# Altium project B38.PrjPcb
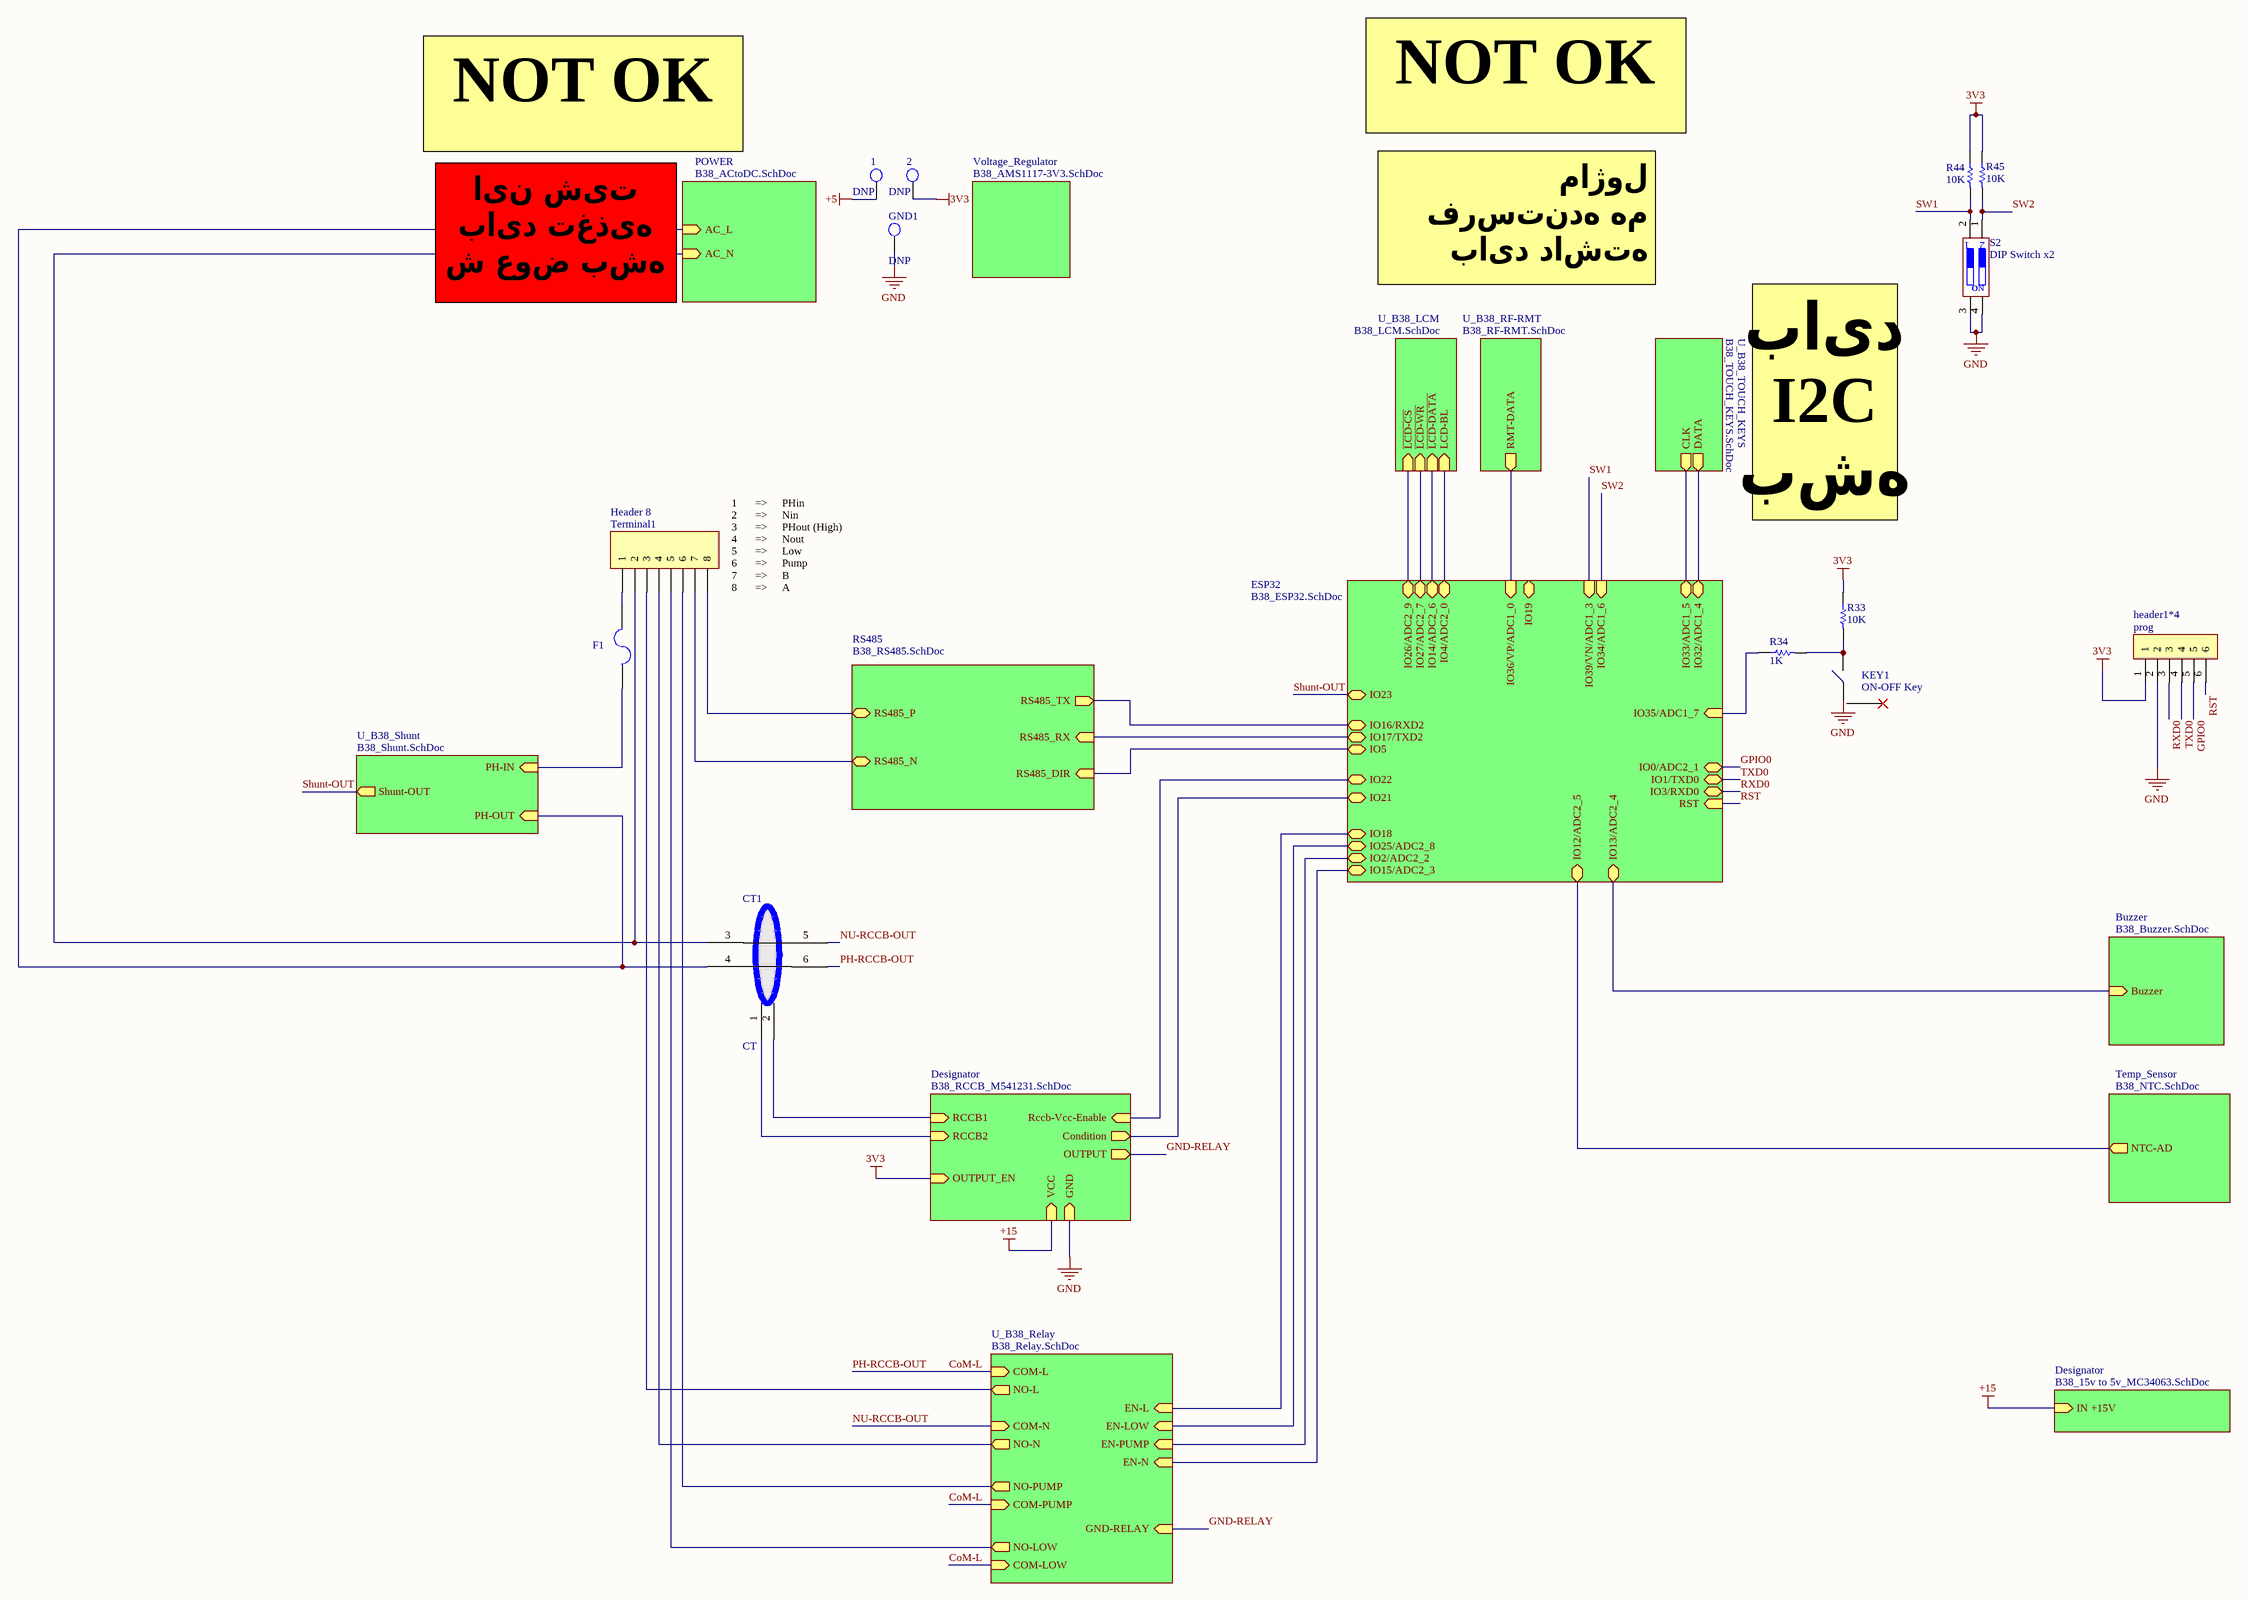
[diagram p0: B38_TopSheet.SchDoc]
14 sheets, 133 parts. Net scope: hierarchical (ports join the sheet entries above them; power ports are global).
Board file: B38_PCB.PcbDoc
Sheets:
  B38_TopSheet.SchDoc
    Voltage_Regulator = B38_AMS1117-3V3.SchDoc
    Temp_Sensor = B38_NTC.SchDoc
    Buzzer = B38_Buzzer.SchDoc
    POWER = B38_ACtoDC.SchDoc
    RS485 = B38_RS485.SchDoc
    ESP32 = B38_ESP32.SchDoc
    U_B38_LCM = B38_LCM.SchDoc
    U_B38_RF-RMT = B38_RF-RMT.SchDoc
    U_B38_TOUCH_KEYS = B38_TOUCH_KEYS.SchDoc
    U_B38_Relay = B38_Relay.SchDoc
    Designator = B38_15v to 5v_MC34063.SchDoc
    Designator = B38_RCCB_M541231.SchDoc
    U_B38_Shunt = B38_Shunt.SchDoc

## Sheet B38_TopSheet.SchDoc
size A2; SheetNumber: 1; SheetTotal: 11

### Parts
1  DNP  [TP]
2  DNP  [TP]
CT1  CT  [RCCB-CT]
F1  F=1.0 A  [FUSE 5X20]  (value not drawn)
GND1  DNP  [TP]
KEY1  ON-OFF Key  [push button]
prog  header1*4  [header-2.54mm]
R33  10K  [RES0603]
R34  1K  [RES0603]
R44  10K  [RES0603]
R45  10K  [RES0603]
S2  DIP Switch x2  [GDS02s-2.54 smd]
Terminal1  Header 8  [Terminal]

### Sub-sheets
Buzzer = B38_Buzzer.SchDoc: Buzzer (in)
Designator = B38_15v to 5v_MC34063.SchDoc: IN +15V (in)
Designator = B38_RCCB_M541231.SchDoc: VCC (in), OUTPUT (out), OUTPUT_EN (in), Condition (out), RCCB1 (in), RCCB2 (in), Rccb-Vcc-Enable (in), GND (in)
ESP32 = B38_ESP32.SchDoc: IO3/RXD0 (bidir), IO1/TXD0 (bidir), IO22 (bidir), IO23 (bidir), IO21 (bidir), IO19 (bidir), IO18 (bidir), IO5 (bidir), IO4/ADC2_0 (bidir), IO15/ADC2_3 (bidir), IO0/ADC2_1 (bidir), IO33/ADC1_5 (bidir), IO2/ADC2_2 (bidir), IO27/ADC2_7 (bidir), IO36/VP/ADC1_0 (in), IO39/VN/ADC1_3 (in), IO14/ADC2_6 (bidir), IO25/ADC2_8 (bidir), IO32/ADC1_4 (bidir), IO16/RXD2 (bidir), IO17/TXD2 (bidir), RST (in), IO13/ADC2_4 (bidir), IO12/ADC2_5 (bidir), IO26/ADC2_9 (bidir), IO34/ADC1_6 (in), IO35/ADC1_7 (in)
POWER = B38_ACtoDC.SchDoc: AC_N (in), AC_L (in)
RS485 = B38_RS485.SchDoc: RS485_DIR (in), RS485_P (bidir), RS485_TX (out), RS485_RX (in), RS485_N (bidir)
Temp_Sensor = B38_NTC.SchDoc: NTC-AD (out)
U_B38_LCM = B38_LCM.SchDoc: ~{LCD-CS} (in), ~{LCD-WR} (in), ~{LCD-DATA} (in), LCD-BL (in)
U_B38_Relay = B38_Relay.SchDoc: NO-L (out), COM-L (in), EN-L (in), NO-N (out), COM-N (in), EN-N (in), COM-PUMP (in), COM-LOW (in), NO-PUMP (out), NO-LOW (out), EN-LOW (in), EN-PUMP (in), GND-RELAY (in)
U_B38_RF-RMT = B38_RF-RMT.SchDoc: RMT-DATA (out)
U_B38_Shunt = B38_Shunt.SchDoc: PH-IN (in), Shunt-OUT (out), PH-OUT (in)
U_B38_TOUCH_KEYS = B38_TOUCH_KEYS.SchDoc: DATA (out), CLK (out)
Voltage_Regulator = B38_AMS1117-3V3.SchDoc: no entries

### Nets
3V3: 2.1 prog.1 R33.1 R44.1 R45.1 ; sheet Designator/OUTPUT_EN
+5: 1.1
+15: sheet Designator/IN +15V, sheet Designator/VCC
GND: GND1.1 KEY1.1 prog.2 S2.3 S2.4 ; sheet Designator/GND
AC_L: CT1.4 ; sheet POWER/AC_L, sheet U_B38_Shunt/PH-OUT
AC_N: CT1.3 Terminal1.2 ; sheet POWER/AC_N
CoM-L: CT1.6 ; sheet U_B38_Relay/COM-L, sheet U_B38_Relay/COM-PUMP, sheet U_B38_Relay/COM-LOW  [also labelled PH-RCCB-OUT]
GND-RELAY: sheet U_B38_Relay/GND-RELAY, sheet Designator/OUTPUT
GPIO0: prog.5 ; sheet ESP32/IO0/ADC2_1
NU-RCCB-OUT: CT1.5 ; sheet U_B38_Relay/COM-N
RS485_DIR: sheet RS485/RS485_DIR, sheet ESP32/IO5
RS485_N: Terminal1.7 ; sheet RS485/RS485_N
RS485_P: Terminal1.8 ; sheet RS485/RS485_P
RS485_RX: sheet RS485/RS485_RX, sheet ESP32/IO17/TXD2
RS485_TX: sheet RS485/RS485_TX, sheet ESP32/IO16/RXD2
RST: prog.6 ; sheet ESP32/RST
RXD0: prog.3 ; sheet ESP32/IO3/RXD0
Shunt-OUT: sheet ESP32/IO23, sheet U_B38_Shunt/Shunt-OUT
SW1: R44.2 S2.2 ; sheet ESP32/IO39/VN/ADC1_3
SW2: R45.2 S2.1 ; sheet ESP32/IO34/ADC1_6
TXD0: prog.4 ; sheet ESP32/IO1/TXD0
NetC12_1: CT1.2 ; sheet Designator/RCCB1
NetC12_2: CT1.1 ; sheet Designator/RCCB2
NetC16_2: sheet Temp_Sensor/NTC-AD, sheet ESP32/IO12/ADC2_5
NetF1_1: F1.1 ; sheet U_B38_Shunt/PH-IN
NetF1_2: F1.2 Terminal1.1
NetKEY1_2: KEY1.2 R33.2 R34.2
NetQ6_1: sheet ESP32/IO21, sheet Designator/Condition
NetR2_2: sheet Buzzer/Buzzer, sheet ESP32/IO13/ADC2_4
NetR5_2: sheet ESP32/IO26/ADC2_9, sheet U_B38_LCM/~{LCD-CS}
NetR6_2: sheet ESP32/IO27/ADC2_7, sheet U_B38_LCM/~{LCD-WR}
NetR7_2: sheet ESP32/IO14/ADC2_6, sheet U_B38_LCM/~{LCD-DATA}
NetR9_2: sheet ESP32/IO4/ADC2_0, sheet U_B38_LCM/LCD-BL
NetR12_1: sheet ESP32/IO22, sheet Designator/Rccb-Vcc-Enable
NetR19_2: sheet ESP32/IO18, sheet U_B38_Relay/EN-L
NetR20_2: sheet ESP32/IO15/ADC2_3, sheet U_B38_Relay/EN-N
NetR21_2: sheet ESP32/IO25/ADC2_8, sheet U_B38_Relay/EN-LOW
NetR22_2: sheet ESP32/IO2/ADC2_2, sheet U_B38_Relay/EN-PUMP
NetR34_1: R34.1 ; sheet ESP32/IO35/ADC1_7
NetRL1_2: Terminal1.3 ; sheet U_B38_Relay/NO-L
NetRL2_3: Terminal1.4 ; sheet U_B38_Relay/NO-N
NetRL3_3: Terminal1.5 ; sheet U_B38_Relay/NO-LOW
NetRL4_1: Terminal1.6 ; sheet U_B38_Relay/NO-PUMP
NetRMT1_2: sheet ESP32/IO36/VP/ADC1_0, sheet U_B38_RF-RMT/RMT-DATA
NetU3_8: sheet ESP32/IO32/ADC1_4, sheet U_B38_TOUCH_KEYS/DATA
NetU3_9: sheet ESP32/IO33/ADC1_5, sheet U_B38_TOUCH_KEYS/CLK

Not connected (* = marked no-connect by the designer): KEY1 0(B)*

### Notes on the sheet
- NOT OK
- ماژول فرستنده هم باید داشته باشم
- این شیت باید تغذیه ش عوض بشه به 220 به 15 ولت
- باید I2C بشه
- (near Terminal1) 1      =>     PHin
  2      =>     Nin
  3      =>     PHout (High)
  4      =>     Nout
  5      =>     Low
  6      =>     Pump
  7      =>     B
  8      =>     A
- Title
- Size:
- Date:
- File:
- A2
- Number:
- Time:
- Revision:
- Sheet
- of
- (in symbol DIP Switch x2) ON

### Library data of the parts
1 2 GND1 = TP
F1 = Fuse 5x20 with holdeer pins: Fuses 5x20; Designer: Abbas Basereh; Desc.: fuse with holder pins 5x20; Data: 28-12-2016
KEY1 = SW
R33 R34 R44 R45 = Res1: Resistor 5%; Manufacturer: Panasonic; PN: ERJ3GEYJ101V; Value: 100Ω
Terminal1 = Header 8: Header, 8-Pin

## Sheet B38_AMS1117-3V3.SchDoc
size A4; SheetNumber: 3; SheetTotal: 11
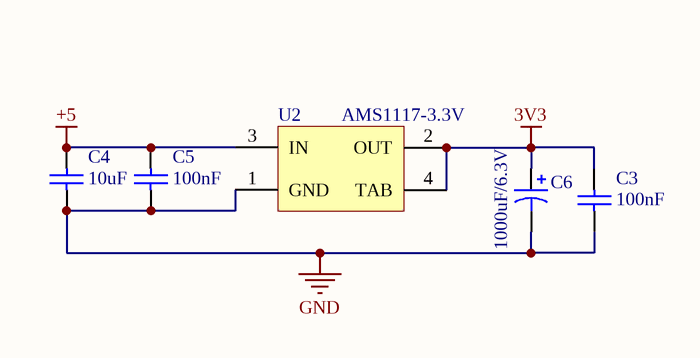
[diagram p1: B38_AMS1117-3V3.SchDoc]

### Parts
(Parts that share a designator on the sheet are numbered #1, #2 ... from top to bottom, then left to right.)
C3#1  100nF  [CAP0603]
C4  10uF  [cap1206]
C5  100nF  [CAP0603]
C6  1000uF/6.3V  [Cap electrolitic radial 8x11.5]
U2  AMS1117-3.3V  [SOT-223]

### Nets
3V3: C3#1.2 C6.1 U2.2(OUT) U2.4(TAB)
+5: C4.2 C5.2 U2.3(IN)
GND: C3#1.1 C4.1 C5.1 C6.2 U2.1(GND)

### Library data of the parts
C3#1 C4 C5 = Cap: Capacitor 6.3V, 10%; Manufacturer: Walsin; PN: 0603X106K6R3
  C3#1 C5: Value: 100nF
  C4: Value: 10uF
C6 = Cap Pol1: Aluminum electrolytic capacitor  220uF/6.3vV/8*11.5; Value: 1000uF/6.3V
U2 = ASM1117: Low Dropout Linear Regulator , Positive , Fixed , Output Voltage : 3.3V , Output Current : 1A ; Input Voltage :18V; PN: AMS1117-3.3V; Value: AMS1117-3.3V

## Sheet B38_NTC.SchDoc
size A4; SheetNumber: 5; SheetTotal: 11
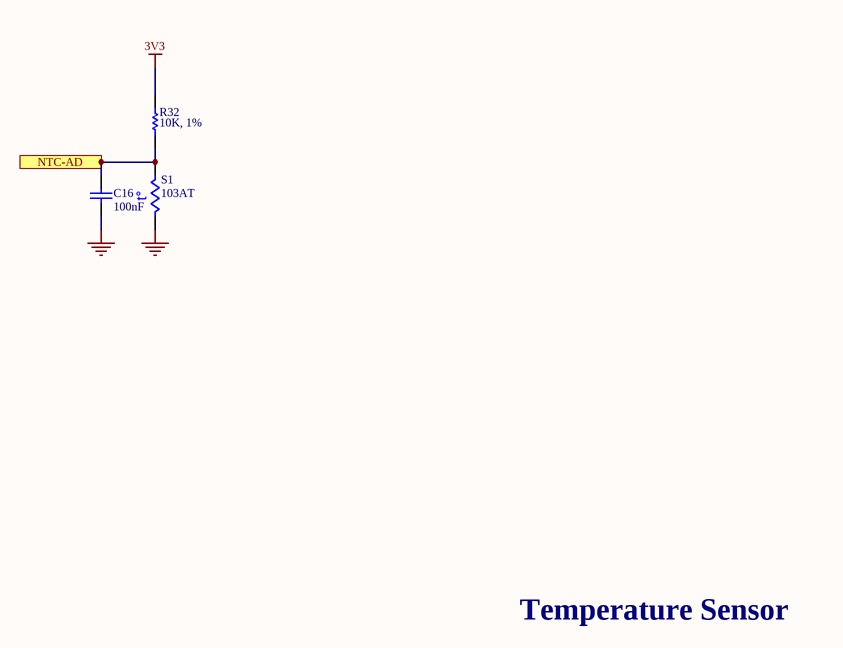
[diagram p2: B38_NTC.SchDoc]

### Parts
C16  100nF  [CAP0603]
R32  10K, 1%  [RES0603]
S1  103AT  [103AT]

### Ports
NTC-AD (out)

### Nets
3V3: R32.2
GND: C16.1 S1.2
NetC16_2: C16.2 R32.1 S1.1 ; port NTC-AD

### Notes on the sheet
- Temperature Sensor
- (in symbol Res Thermal) t°

### Library data of the parts
C16 = Cap: Capacitor 10V, 10%; Manufacturer: Walsin; PN: 0603B104K100CT; Value: 100nF
R32 = Res1: Resistor; Manufacturer: Panasonic; Value: 120Ω
S1 = Res Thermal: Thermistor

## Sheet B38_Buzzer.SchDoc
size A4; SheetNumber: 7; SheetTotal: 11
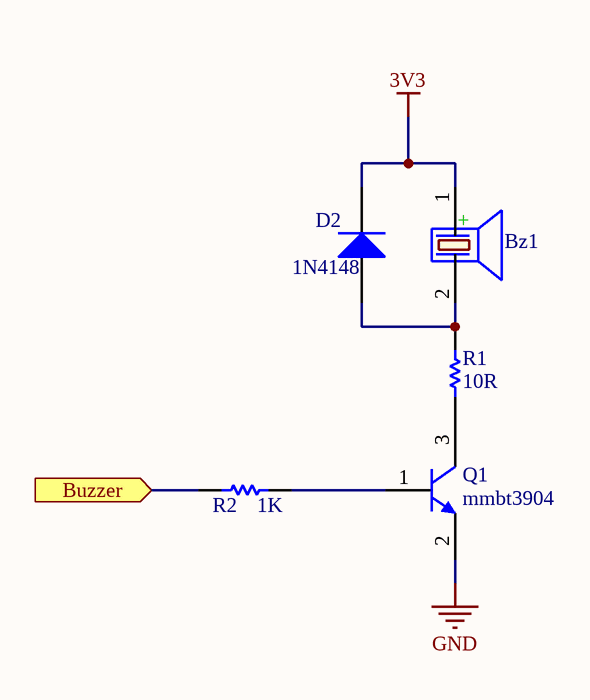
[diagram p3: B38_Buzzer.SchDoc]

### Parts
Bz1  Buzzer  [Buzzer]  (value not drawn)
D2  1N4148  [SOD-123]
Q1  mmbt3904  [SOT-23]
R1  10R  [RES0603]
R2  1K  [RES0603]

### Ports
Buzzer (in)

### Nets
3V3: Bz1.1(+) D2.2(K)
GND: Q1.2(E)
NetBz1_2: Bz1.2(-) D2.1(A) R1.1
NetQ1_1: Q1.1(B) R2.1
NetQ1_3: Q1.3(C) R1.2
NetR2_2: R2.2 ; port Buzzer

### Library data of the parts
Bz1 = PIEZO BUZZER: PIEZO BUZZER ACTIVE; Manufacturer: HNDZ; PN: MLT-7525; Value: Buzzer
D2 = Diode 1N4148: High Conductance Fast Diode; Manufacturer: VISHAY; PN: 1N4148WS; Value: 1N4148WS
R1 = Res1: as R33 on sheet B38_TopSheet
R2 = Res1: Resistor 5%; Manufacturer: Panasonic; PN: ERJ3GEYJ102V; Value: 1KΩ

## Sheet B38_ACtoDC.SchDoc
size A4
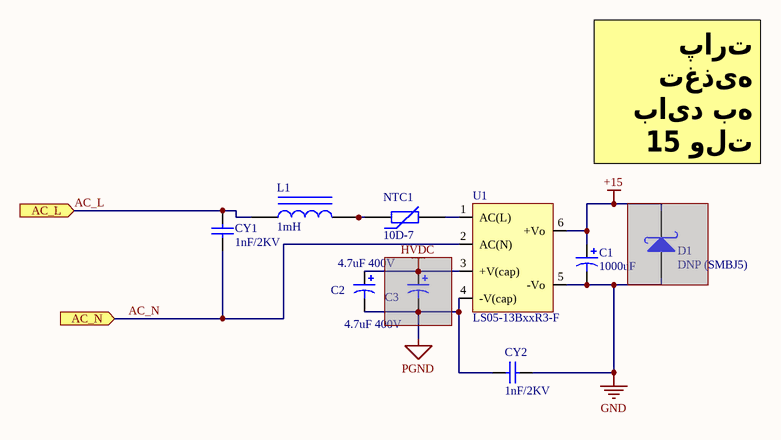
[diagram p4: B38_ACtoDC.SchDoc]

### Parts
(Parts that share a designator on the sheet are numbered #1, #2 ... from top to bottom, then left to right.)
C1  1000uF  [Cap electrolitic radial 8x11.5]
C2  4.7uF 400V  [Cap electrolitic radial 8x11.5]
C3#2  4.7uF 400V  [Cap electrolitic radial 8x11.5]  (masked out: inside a compile mask, not in the netlist)
CY1  1nF/2KV  [NTC 7.5-D]
CY2  1nF/2KV  [NTC 7.5-D]
D1  DNP (SMBJ5)  [DO-214]  (masked out: inside a compile mask, not in the netlist)
L1  1mH  [Inductor Stand]
NTC1  10D-7  [NTC 7.5-D]
U1  LS05-13BxxR3-F  [LS05-13BxxR3]

### Ports
AC_L (in), AC_N (in)

### Nets
+15: C1.1 U1.6(+Vo)
GND: C1.2 CY2.2 U1.5(-Vo)
PGND: C2.2 CY2.1 U1.4(-V(cap))
AC_L: CY1.2 L1.1 ; port AC_L
AC_N: CY1.1 U1.2(AC(N)) ; port AC_N
NetC2_1: C2.1 U1.3(+V(cap))
NetL1_2: L1.2 NTC1.1
NetNTC1_2: NTC1.2 U1.1(AC(L))

### Notes on the sheet
- پارت تغذیه باید به 15 ولت تغییر بکنه

### Library data of the parts
C1 = Cap Pol1: Aluminum electrolytic capacitor  22uF/450V/Φ12.5*20; Value: 1000uF
C2 C3#2 = Cap Pol1: Aluminum electrolytic capacitor  4.7uF/400V/Φ8*11.5; Value: 4.7uF 400V
CY1 CY2 = CAP SMD PACKAGE: Capacitor 2KV/10%; Manufacturer: Walsin; PN: C1206X102KGRACAUTO; VALUE: 1nF/2KV
D1 = 1N5822 SMD: TVS Diode 5V; Manufacturer: LittelFuse; PN: SMBJ5.0A; Value: SMBJ5.0A
L1 = Inductor Iron: 4.7mH/15Ω/0.1A; Value: 1mH
NTC1 = Res Varistor: Varistor (Voltage-Sensitive Resistor); Code_IPC: 10R 1A

## Sheet B38_RS485.SchDoc
size A4
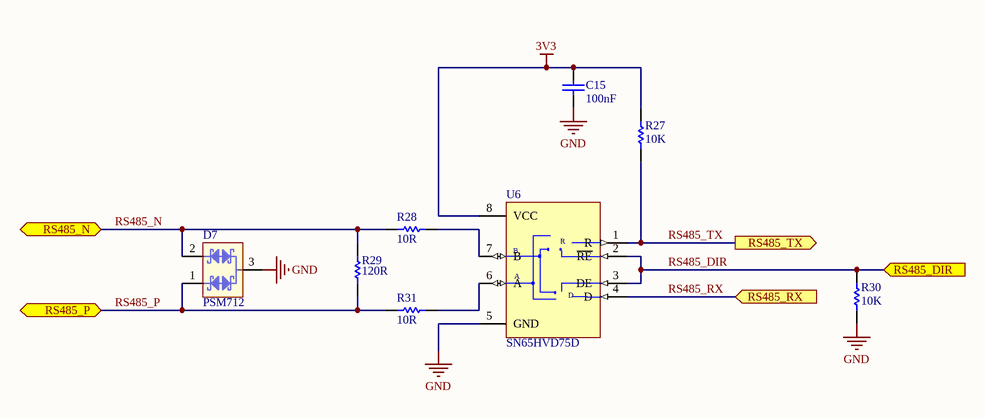
[diagram p5: B38_RS485.SchDoc]

### Parts
C15  100nF  [CAP0603]
D7  PSM712  [SOT-23]
R27  10K  [RES0603]
R28  10R  [RES0603]
R29  120R  [RES0603]
R30  10K  [RES0603]
R31  10R  [RES0603]
U6  SN65HVD75D  [SO-8N]

### Ports
RS485_DIR (in), RS485_N (bidir), RS485_P (bidir), RS485_RX (in), RS485_TX (out)

### Nets
3V3: C15.2 R27.2 U6.8(VCC)
GND: C15.1 D7.3(C) R30.2 U6.5(GND)
RS485_DIR: R30.1 U6.2(~{RE}) U6.3(DE) ; port RS485_DIR
RS485_N: D7.2(K) R28.2 R29.2 ; port RS485_N
RS485_P: D7.1(A) R29.1 R31.2 ; port RS485_P
RS485_RX: U6.4(D) ; port RS485_RX
RS485_TX: R27.1 U6.1(R) ; port RS485_TX
NetR28_1: R28.1 U6.7(B)
NetR31_1: R31.1 U6.6(A)

### Library data of the parts
C15 = Cap: as C16 on sheet B38_NTC; Value: 100nF
D7 = PSM712: PSM712 is an asymmetrical transient voltage suppressor (TVS) array; PN: PSM712; Value: PSM712
R27 R30 = Res1: Resistor; Value: 10k
R28 R31 = Res1: Resistor 5%; Manufacturer: Panasonic; Value: 10Ω; PN: ERJ3GEYJ100V
R29 = Res1: as R32 on sheet B38_NTC
U6 = SN65HVD75D: RS-485/RS-422 Transceiver; PN: SN65HVD75D; Value: SN65HVD75D

## Sheet B38_ESP32.SchDoc
size A4; SheetNumber: 2; SheetTotal: 11
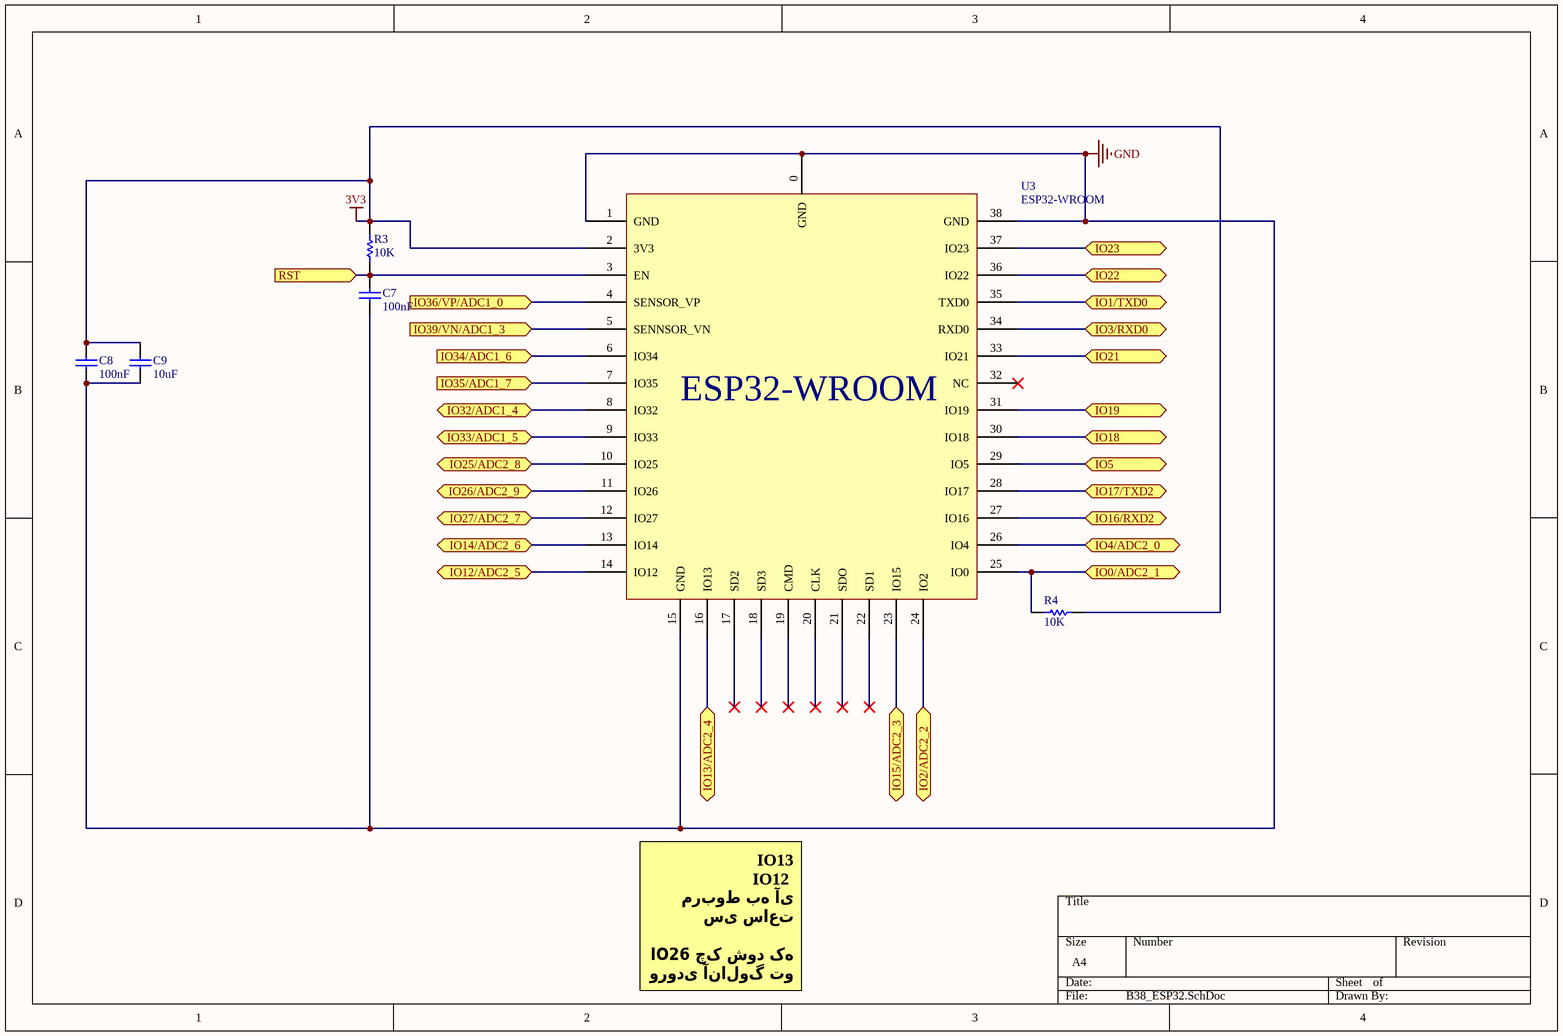
[diagram p6: B38_ESP32.SchDoc]

### Parts
C7  100nF  [CAP0603]
C8  100nF  [CAP0603]
C9  10uF  [CAP1206]
R3  10K  [RES0603]
R4  10K  [RES0603]
U3  ESP32-WROOM  [ESP32 WROOM]

### Ports
IO0/ADC2_1 (bidir), IO1/TXD0 (bidir), IO2/ADC2_2 (bidir), IO3/RXD0 (bidir), IO4/ADC2_0 (bidir), IO5 (bidir), IO12/ADC2_5 (bidir), IO13/ADC2_4 (bidir), IO14/ADC2_6 (bidir), IO15/ADC2_3 (bidir), IO16/RXD2 (bidir), IO17/TXD2 (bidir), IO18 (bidir), IO19 (bidir), IO21 (bidir), IO22 (bidir), IO23 (bidir), IO25/ADC2_8 (bidir), IO26/ADC2_9 (bidir), IO27/ADC2_7 (bidir), IO32/ADC1_4 (bidir), IO33/ADC1_5 (bidir), IO34/ADC1_6 (in), IO35/ADC1_7 (in), IO36/VP/ADC1_0 (in), IO39/VN/ADC1_3 (in), RST (in)

### Nets
3V3: C8.2 C9.2 R3.2 R4.2 U3.2(3V3)
GND: C7.1 C8.1 C9.1 U3.0(GND) U3.1(GND) U3.15(GND) U3.38(GND)
GPIO0: R4.1 U3.25(IO0) ; port IO0/ADC2_1
RS485_DIR: U3.29(IO5) ; port IO5
RS485_RX: U3.28(IO17) ; port IO17/TXD2
RS485_TX: U3.27(IO16) ; port IO16/RXD2
RST: C7.2 R3.1 U3.3(EN) ; port RST
RXD0: U3.34(RXD0) ; port IO3/RXD0
Shunt-OUT: U3.37(IO23) ; port IO23
SW1: U3.5(SENNSOR_VN) ; port IO39/VN/ADC1_3
SW2: U3.6(IO34) ; port IO34/ADC1_6
TXD0: U3.35(TXD0) ; port IO1/TXD0
NetC16_2: U3.14(IO12) ; port IO12/ADC2_5
NetQ6_1: U3.33(IO21) ; port IO21
NetR2_2: U3.16(IO13) ; port IO13/ADC2_4
NetR5_2: U3.11(IO26) ; port IO26/ADC2_9
NetR6_2: U3.12(IO27) ; port IO27/ADC2_7
NetR7_2: U3.13(IO14) ; port IO14/ADC2_6
NetR9_2: U3.26(IO4) ; port IO4/ADC2_0
NetR12_1: U3.36(IO22) ; port IO22
NetR19_2: U3.30(IO18) ; port IO18
NetR20_2: U3.23(IO15) ; port IO15/ADC2_3
NetR21_2: U3.10(IO25) ; port IO25/ADC2_8
NetR22_2: U3.24(IO2) ; port IO2/ADC2_2
NetR34_1: U3.7(IO35) ; port IO35/ADC1_7
NetRMT1_2: U3.4(SENSOR_VP) ; port IO36/VP/ADC1_0
NetU3_8: U3.8(IO32) ; port IO32/ADC1_4
NetU3_9: U3.9(IO33) ; port IO33/ADC1_5
NetU3_31: U3.31(IO19) ; port IO19

Not connected (* = marked no-connect by the designer): U3 17(SD2)* 18(SD3)* 19(CMD)* 20(CLK)* 21(SDO)* 22(SD1)* 32(NC)*

### Notes on the sheet
- IO13
  IO12
  مربوط به آی سی ساعت
  IO26 چک شود که ورودی آنالوگ تو دیجیتال می باشد یا خیر؟

### Library data of the parts
C7 C8 = Cap: Capacitor; Published: 8-Jun-2000; Revision: July-2002: Re-released for DXP Platform.; Publisher: Altium Limited; Value: 100nF
C9 = Cap: Capacitor; Value: 100nF; Published: 8-Jun-2000; Revision: July-2002: Re-released for DXP Platform.; Publisher: Altium Limited
R3 R4 = Res1: as R33 on sheet B38_TopSheet
U3 = ESP32-WROOM: ESP32 Wroom Module

## Sheet B38_LCM.SchDoc
size A3; SheetNumber: 10; SheetTotal: 11
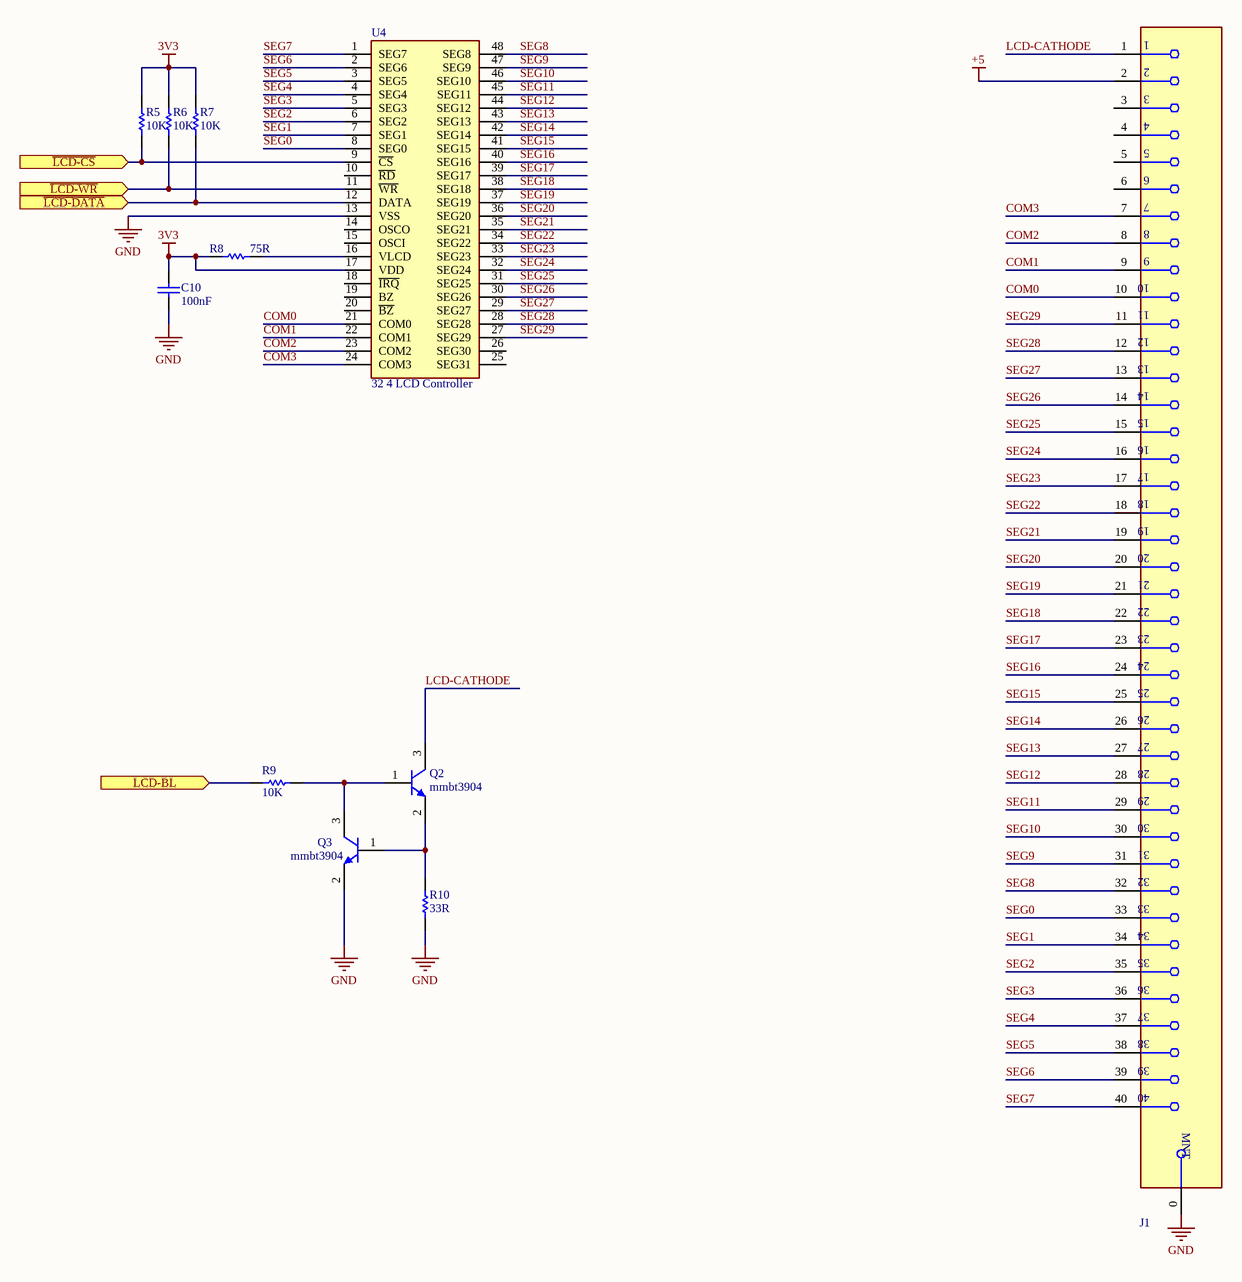
[diagram p7: B38_LCM.SchDoc]

### Parts
C10  100nF  [CAP0603]
J1  4-1734592-0  [FFC40PIN TOP]  (value not drawn)
Q2  mmbt3904  [SOT-23]
Q3  mmbt3904  [SOT-23]
R5  10K  [RES0603]
R6  10K  [RES0603]
R7  10K  [RES0603]
R8  75R  [RES0603]
R9  10K  [RES0603]
R10  33R  [RES0603]
U4  32 4 LCD Controller  [SOP64P1035X277-48N]

### Ports
LCD-BL (in), ~{LCD-CS} (in), ~{LCD-DATA} (in), ~{LCD-WR} (in)

### Nets
3V3: C10.1 R5.1 R6.1 R7.1 R8.1 U4.17(VDD)
+5: J1.2
GND: C10.2 J1.0(MNT_1) Q3.2(E) R10.1 U4.13(VSS)
COM0: J1.10 U4.21(COM0)
COM1: J1.9 U4.22(COM1)
COM2: J1.8 U4.23(COM2)
COM3: J1.7 U4.24(COM3)
LCD-CATHODE: J1.1 Q2.3(C)
SEG0: J1.33 U4.8(SEG0)
SEG1: J1.34 U4.7(SEG1)
SEG2: J1.35 U4.6(SEG2)
SEG3: J1.36 U4.5(SEG3)
SEG4: J1.37 U4.4(SEG4)
SEG5: J1.38 U4.3(SEG5)
SEG6: J1.39 U4.2(SEG6)
SEG7: J1.40 U4.1(SEG7)
SEG8: J1.32 U4.48(SEG8)
SEG9: J1.31 U4.47(SEG9)
SEG10: J1.30 U4.46(SEG10)
SEG11: J1.29 U4.45(SEG11)
SEG12: J1.28 U4.44(SEG12)
SEG13: J1.27 U4.43(SEG13)
SEG14: J1.26 U4.42(SEG14)
SEG15: J1.25 U4.41(SEG15)
SEG16: J1.24 U4.40(SEG16)
SEG17: J1.23 U4.39(SEG17)
SEG18: J1.22 U4.38(SEG18)
SEG19: J1.21 U4.37(SEG19)
SEG20: J1.20 U4.36(SEG20)
SEG21: J1.19 U4.35(SEG21)
SEG22: J1.18 U4.34(SEG22)
SEG23: J1.17 U4.33(SEG23)
SEG24: J1.16 U4.32(SEG24)
SEG25: J1.15 U4.31(SEG25)
SEG26: J1.14 U4.30(SEG26)
SEG27: J1.13 U4.29(SEG27)
SEG28: J1.12 U4.28(SEG28)
SEG29: J1.11 U4.27(SEG29)
NetQ2_1: Q2.1(B) Q3.3(C) R9.1
NetQ2_2: Q2.2(E) Q3.1(B) R10.2
NetR5_2: R5.2 U4.9(~{CS}) ; port ~{LCD-CS}
NetR6_2: R6.2 U4.11(~{WR}) ; port ~{LCD-WR}
NetR7_2: R7.2 U4.12(DATA) ; port ~{LCD-DATA}
NetR8_2: R8.2 U4.16(VLCD)
NetR9_2: R9.2 ; port LCD-BL

Not connected (* = marked no-connect by the designer): J1 3 4 5 6; U4 10(~{RD}) 14(OSCO) 15(OSCI) 18(~{IRQ}) 19(BZ) 20(~{BZ}) 25(SEG31) 26(SEG30)

### Notes on the sheet
- (in symbol 4-1734592-0) MNT

### Library data of the parts
C10 = Cap: Capacitor; Published: 8-Jun-2000; Revision: July-2002: Re-released for DXP Platform.; Publisher: Altium Limited; Value: 100nF
R5-R10 = Res1: as R33 on sheet B38_TopSheet
U4 = HT1621B: Integrated Circuit; Manufacturer_Name: Holtek; Manufacturer_Part_Number: HT1621B(48SSOP); Height: 2.769mm

## Sheet B38_RF-RMT.SchDoc
size A
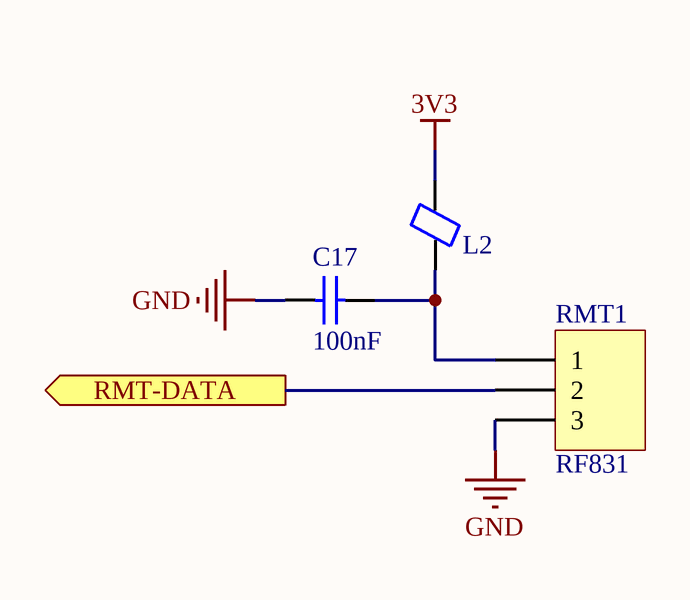
[diagram p8: B38_RF-RMT.SchDoc]

### Parts
C17  100nF  [CAP0603]
L2  Ferrite Bead SMD  [FB0603]  (value not drawn)
RMT1  RF831  [RF-RMT]

### Ports
RMT-DATA (out)

### Nets
3V3: L2.2
GND: C17.2 RMT1.3
NetC17_1: C17.1 L2.1 RMT1.1
NetRMT1_2: RMT1.2 ; port RMT-DATA

### Library data of the parts
C17 = Cap: as C16 on sheet B38_NTC; Value: 100nF
L2 = Ferrite Bead SMD Package: Ferrite Bead SMD, 100R; Designer: Ali Hafizi
RMT1 = Header 3: Header, 3-Pin; LatestRevisionDate: 17-Jul-2002; LatestRevisionNote: Re-released for DXP Platform.; Publisher: Altium Limited

## Sheet B38_TOUCH_KEYS.SchDoc
size A
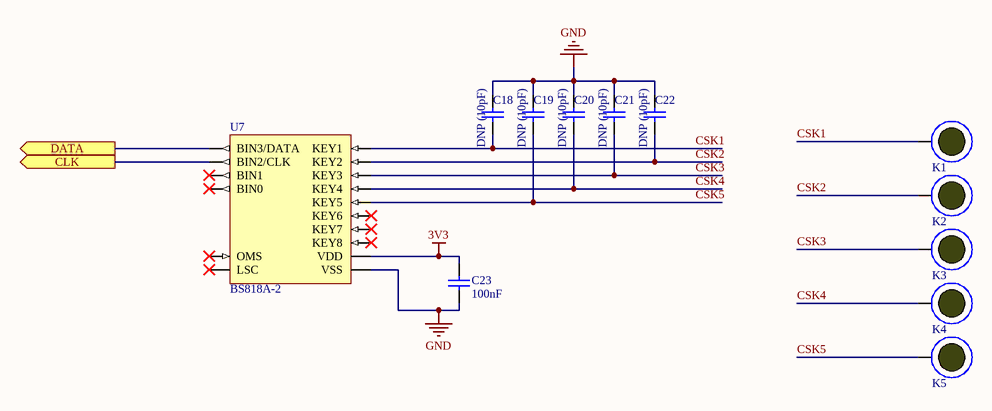
[diagram p9: B38_TOUCH_KEYS.SchDoc]

### Parts
C18  DNP (10pF)  [CAP0603]
C19  DNP (10pF)  [CAP0603]
C20  DNP (10pF)  [CAP0603]
C21  DNP (10pF)  [CAP0603]
C22  DNP (10pF)  [CAP0603]
C23  100nF  [CAP0603]
K1  (no value)  [PCBComponent_1]
K2  (no value)  [PCBComponent_1]
K3  (no value)  [PCBComponent_1]
K4  (no value)  [PCBComponent_1]
K5  (no value)  [PCBComponent_1]
U7  BS818A-2  [SO16]

### Ports
CLK (out), DATA (out)

### Nets
3V3: C23.1 U7.10(VDD)
GND: C18.1 C19.1 C20.1 C21.1 C22.1 C23.2 U7.9(VSS)
CSK1: C18.2 K1.1 U7.1(KEY1)
CSK2: C22.2 K2.1 U7.2(KEY2)
CSK3: C21.2 K3.1 U7.3(KEY3)
CSK4: C20.2 K4.1 U7.4(KEY4)
CSK5: C19.2 K5.1 U7.5(KEY5)
NetU3_8: U7.16(BIN3/DATA) ; port DATA
NetU3_9: U7.15(BIN2/CLK) ; port CLK

Not connected (* = marked no-connect by the designer): U7 6(KEY6)* 7(KEY7)* 8(KEY8)* 11(LSC)* 12(OMS)* 13(BIN0)* 14(BIN1)*

### Library data of the parts
C18-C22 = Cap: Capacitor 10V, 10%; Manufacturer: Walsin; PN: 0603B104K100CT; Value: 100nF
C23 = Cap: as C16 on sheet B38_NTC; Value: 100nF
K1-K5 = TPAD
U7 = BS818A-2 : HOLTEK_Touch key input pin, Operating voltage: 2.2V~5.5V - 8 Key input - Serial output

## Sheet B38_Relay.SchDoc
size 558 x 431 mm
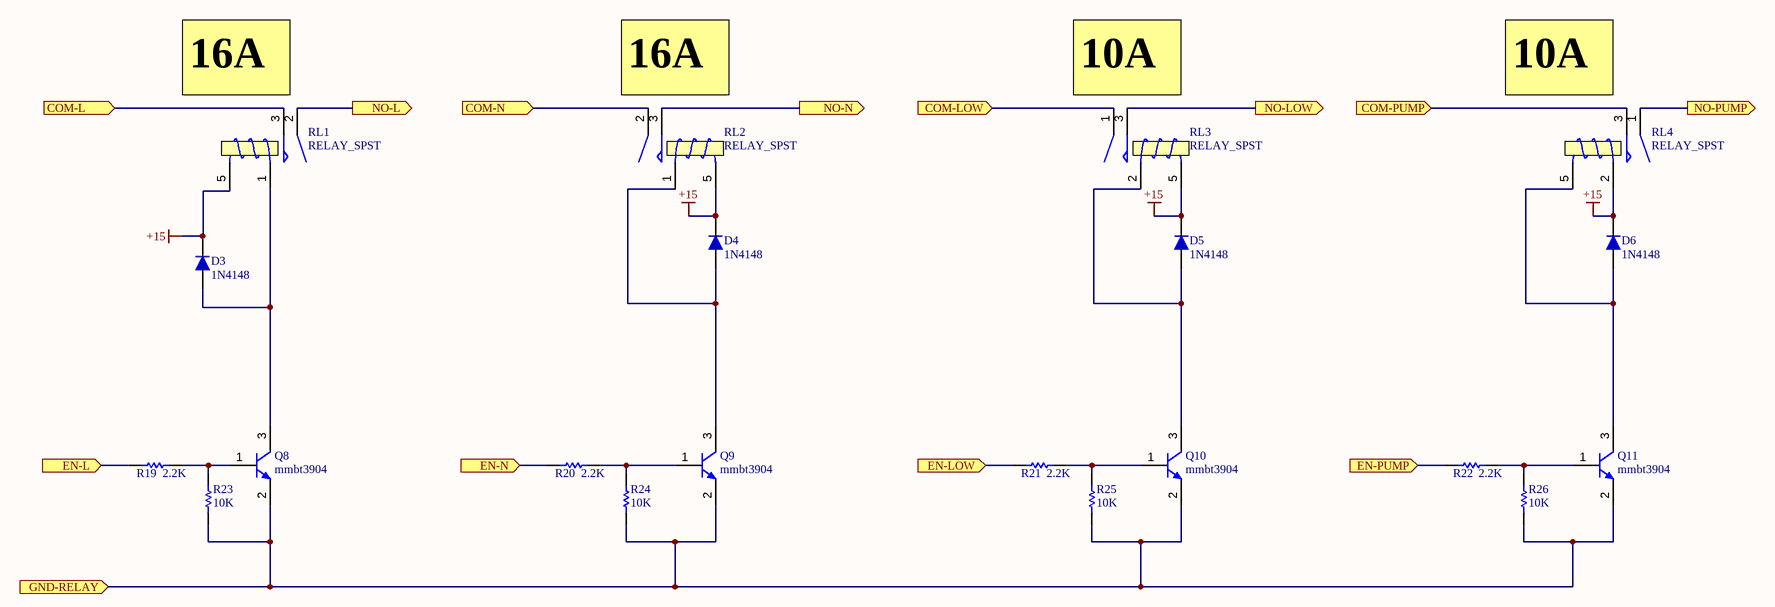
[diagram p10: B38_Relay.SchDoc]

### Parts
D3  1N4148  [SOD-123]
D4  1N4148  [SOD-123]
D5  1N4148  [SOD-123]
D6  1N4148  [SOD-123]
Q8  mmbt3904  [SOT-23]
Q9  mmbt3904  [SOT-23]
Q10  mmbt3904  [SOT-23]
Q11  mmbt3904  [SOT-23]
R19  2.2K  [RES0603]
R20  2.2K  [RES0603]
R21  2.2K  [RES0603]
R22  2.2K  [RES0603]
R23  10K  [RES0603]
R24  10K  [RES0603]
R25  10K  [RES0603]
R26  10K  [RES0603]
RL1  RELAY_SPST  [RELAY-HF115F]
RL2  RELAY_SPST  [RELAY-HF115F]
RL3  RELAY_SPST  [REL-SEDNA-4PIN]
RL4  RELAY_SPST  [REL-SEDNA-4PIN]

### Ports
COM-L (in), COM-LOW (in), COM-N (in), COM-PUMP (in), EN-L (in), EN-LOW (in), EN-N (in), EN-PUMP (in), GND-RELAY (in), NO-L (out), NO-LOW (out), NO-N (out), NO-PUMP (out)

### Nets
+15: D3.2 D4.2 D5.2 D6.2 RL1.5(T2) RL2.5(T2) RL3.5(T2) RL4.2(T1)
CoM-L: RL1.3(NO) RL3.1(COM) RL4.3(NO) ; port COM-L, port COM-LOW, port COM-PUMP
GND-RELAY: Q8.2(E) Q9.2(E) Q10.2(E) Q11.2(E) R23.2 R24.2 R25.2 R26.2 ; port GND-RELAY
NU-RCCB-OUT: RL2.2(COM) ; port COM-N
NetD3_1: D3.1 Q8.3(C) RL1.1(T1)
NetD4_1: D4.1 Q9.3(C) RL2.1(T1)
NetD5_1: D5.1 Q10.3(C) RL3.2(T1)
NetD6_1: D6.1 Q11.3(C) RL4.5(T2)
NetQ8_1: Q8.1(B) R19.1 R23.1
NetQ9_1: Q9.1(B) R20.1 R24.1
NetQ10_1: Q10.1(B) R21.1 R25.1
NetQ11_1: Q11.1(B) R22.1 R26.1
NetR19_2: R19.2 ; port EN-L
NetR20_2: R20.2 ; port EN-N
NetR21_2: R21.2 ; port EN-LOW
NetR22_2: R22.2 ; port EN-PUMP
NetRL1_2: RL1.2(COM) ; port NO-L
NetRL2_3: RL2.3(NO) ; port NO-N
NetRL3_3: RL3.3(NO) ; port NO-LOW
NetRL4_1: RL4.1(COM) ; port NO-PUMP

### Notes on the sheet
- (near RL1) 16A
- (near RL2) 16A
- (near RL3) 10A
- (near RL4) 10A
- DWG. NO.
- REV.
- SHT.
- REVISION
- DESCRIPTION
- DATE
- APPROVED
- THIS DOCUMENT AND THE DATA DISCLOSED HEREIN OR HEREWITH IS THE PROPERTY OF ALTIUM LIMITED AND MAY BE FREELY DISTRIBUTED IN WHOLE. NO RIGHTS ARE RESERVED OR EXPRESS OR IMPLIED WARANTEE GIVEN.
- ENG:
- DSN:
- APPROVALS
- PROJECT
- DOCUMENT REVISION:
- DESIGN ITEM:
- CHK:
- BOM:
- REFERENCE DOCUMENTS
- PROJECT REVISION:
- TITLE
- FAB DWG:
- PCB DWG:
- ASSY DWG:
- SCALE:
- SIZE
- C
- CAGE CODE
- FILE NAME
- DWG NO.
- SHEET
- OF
- REV

### Library data of the parts
D3-D6 = 1N4148: DIODE GEN PURP 100V 200MA DO35; Published: 2017-1-12; PackageVersion: 2017-1-12; PackageReference: DO 35; Publisher: Abbas Basereh; PackageDescription: DIODE GEN PURP 100V 200MA DO35; ComponentLink1Description: Manufacturer Link; ComponentLink1URL: http://www.digikey.com/product-detail/en/fairchild-on-semiconductor/1N4148/1N4148FS-ND/458603; ComponentLink2Description: Datasheet; PART.NO: 1N4148
R19-R26 = Res1: as R2 on sheet B38_Buzzer

## Sheet B38_15v to 5v_MC34063.SchDoc
size A
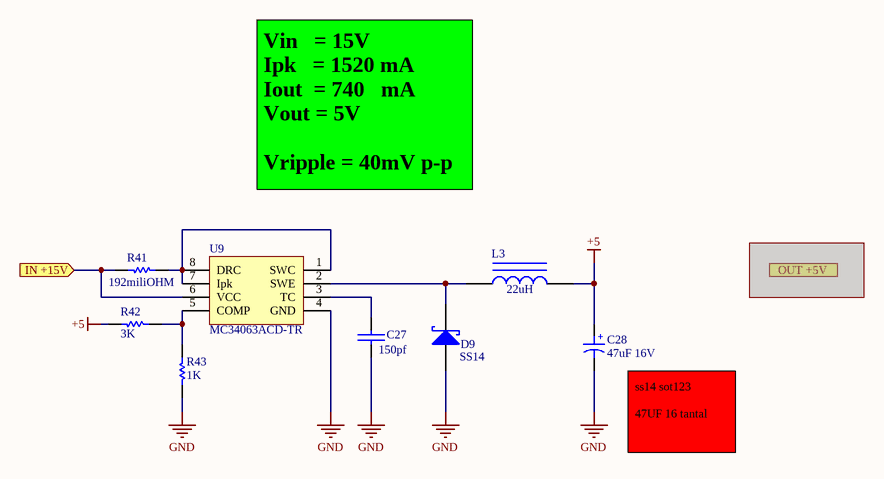
[diagram p11: B38_15v to 5v_MC34063.SchDoc]

### Parts
C27  150pf  [CAP0603]
C28  47uF 16V  [Capacitor Tantalum]
D9  SS14  [M7(1n4007 SMD)DO214]
L3  22uH  [IND-5.8MM]
R41  192miliOHM  [RES0603]
R42  3K  [RES0603]
R43  1K  [RES0603]
U9  MC34063ACD-TR  [SO-8]

### Ports
IN +15V (in), OUT +5V (out)

### Nets
+5: C28.1 L3.2 R42.2
+15: R41.2 U9.6(VCC) ; port IN +15V
GND: C27.2(-) C28.2 D9.1 R43.2 U9.4(GND)
NetC27_1: C27.1(+) U9.3(TC)
NetD9_2: D9.2 L3.1 U9.2(SWE)
NetR41_1: R41.1 U9.1(SWC) U9.7(Ipk) U9.8(DRC)
NetR42_1: R42.1 R43.1 U9.5(COMP)

### Notes on the sheet
- Vin   = 15V
  Ipk   = 1520 mA
  Iout  = 740   mA
  Vout = 5V
  Vripple = 40mV p-p
- (near C28) ss14 sot123
  47UF 16 tantal
- (in symbol Cap_elec) +

### Library data of the parts
C27 = CAP: 37pF ±10% 50V X7R 0603 Multilayer Ceramic Capacitors MLCC - SMD/SMT
C28 = Cap_elec: tantalum capacitor package size A (1206); Designer: Abbas Basereh; VALUE: 1uF; Data: 16-12-2016; Part. No: *
D9 = schottky: 40V 500mV@1A 1A SMA(DO-214AC or SMA) Schottky Barrier Diodes
L3 = Inductor Iron: CD54 220uH = CD54 is L×W×H: 6.1×5.5×4.85mm  Maximum DC Current = 2.3A; Parameter 1: *
R41 = Res: 100mW Thick Film Resistors 50V ±1% ±100ppm/℃ 150mΩ -55℃~+125℃ 0603 Chip Resistor - Surface Mount ROHS; Value: 1K; Published: 8-Jun-2000; LatestRevisionDate: 17-Jul-2002; LatestRevisionNote: Re-released for DXP Platform.; PackageReference: AXIAL-0.3; Publisher: Altium Limited; PackageDescription: Axial Device, Thru-Hole; 2 Leads; 0.3 in Pin Spacing
R42 = Res: 100mW Thick Film Resistors 50V ±1% ±100ppm/℃ 28kΩ -55℃~+125℃ 0603 Chip Resistor - Surface Mount ROHS
R43 = Res: 100mW Thick Film Resistors 50V ±1% ±100ppm/℃ 12kΩ -55℃~+125℃ 0603 Chip Resistor - Surface Mount ROHS; part number: AECR0603F12K0K9
U9 = MC34063: manufacturer: ST; part number: MC34063ACD-TR

## Sheet B38_RCCB_M541231.SchDoc
size A4
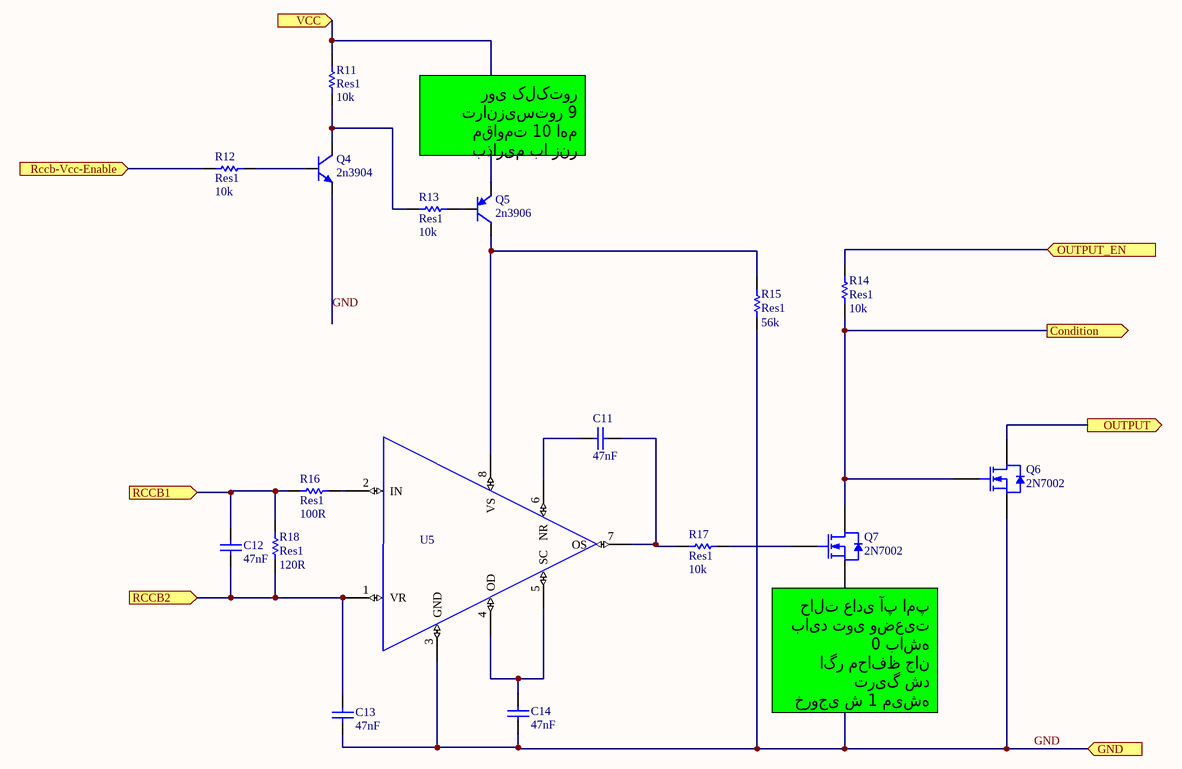
[diagram p12: B38_RCCB_M541231.SchDoc]

### Parts
C11  47nF  [CAP0603]
C12  47nF  [CAP0603]
C13  47nF  [CAP0603]
C14  47nF  [CAP0603]
Q4  2n3904  [sot23]
Q5  2n3906  [sot23]
Q6  2N7002  [sot23]
Q7  2N7002  [sot23]
R11  Res1  value 10k  [RES0603]
R12  Res1  value 10k  [RES0603]
R13  Res1  value 10k  [RES0603]
R14  Res1  value 10k  [RES0603]
R15  Res1  value 56k  [RES0603]
R16  Res1  value 100R  [RES0603]
R17  Res1  value 10k  [RES0603]
R18  Res1  value 120R  [RES0603]
U5  opamp  [SO-8]  (value not drawn)

### Ports
Condition (out), GND (in), OUTPUT (out), OUTPUT_EN (in), RCCB1 (in), RCCB2 (in), Rccb-Vcc-Enable (in), VCC (in)

### Nets
3V3: R14.1 ; port OUTPUT_EN
+15: Q5.2(E) R11.2 ; port VCC
GND: C13.2 C14.2 Q4.2(E) Q6.2(S) Q7.2(S) R15.2 U5.3(GND) ; port GND
GND-RELAY: Q6.3(D) ; port OUTPUT
NetC11_1: C11.1 R17.2 U5.7(OS)
NetC11_2: C11.2 U5.6(NR)
NetC12_1: C12.1 R16.2 R18.1 ; port RCCB1
NetC12_2: C12.2 C13.1 R18.2 U5.1(VR) ; port RCCB2
NetC14_1: C14.1 U5.4(OD) U5.5(SC)
NetQ4_1: Q4.1(B) R12.2
NetQ4_3: Q4.3(C) R11.1 R13.2
NetQ5_1: Q5.1(B) R13.1
NetQ5_3: Q5.3(C) R15.1 U5.8(VS)
NetQ6_1: Q6.1(G) Q7.3(D) R14.2 ; port Condition
NetQ7_1: Q7.1(G) R17.1
NetR12_1: R12.1 ; port Rccb-Vcc-Enable
NetR16_1: R16.1 U5.2(IN)

### Notes on the sheet
- روی کلکتور ترانزیستور 9 مقاومت 10 اهم بذاریم با زنر
- (near Q7) حالت عادی آپ امپ باید توی وضعیت 0 باشه
  اگر محافظ جان تریگ شد
  خروجی ش 1 میشه

### Library data of the parts
C11-C14 = CAP-SMT: 47nF ±5% 50V X7R 0603 Multilayer Ceramic Capacitors MLCC - SMD/SMT; Value: 47nF
Q4 = NPN: E-mail: picpars@gmail.com; De: Seyed Mohsen Ghasemian; web: www.picpars.com
Q5 = PNP: PNP Bipolar Transistor; Published: 8-Jun-2000; LatestRevisionDate: 29-May-2009; LatestRevisionNote: IPC-7351 Footprint Added.; PackageVersion: Aug-1999; PackageReference: SOT-23B; Publisher: Altium Limited; PackageDescription: 3-Pin SOT-23 Package 0.95 mm Pitch, 2.4 mm Lead Span
Q6 Q7 = FDD6690A: MOSFET N-CH 60V 115MA SOT23-3; Manufacturer: Diode; PN: 2N7002-7-F; Value: 2N7002
R11-R15 R17 = Res1: Resistor; Published: 8-Jun-2000; LatestRevisionDate: 17-Jul-2002; LatestRevisionNote: Re-released for DXP Platform.; PackageReference: AXIAL-0.3; Publisher: Altium Limited; PackageDescription: Axial Device, Thru-Hole; 2 Leads; 0.3 in Pin Spacing
R16 = Res1: 100mW Thick Film Resistors 50V ±1% ±100ppm/℃ 100Ω -55℃~+125℃ 0603 Chip Resistor - Surface Mount ROHS; Published: 8-Jun-2000; LatestRevisionDate: 17-Jul-2002; LatestRevisionNote: Re-released for DXP Platform.; PackageReference: AXIAL-0.3; Publisher: Altium Limited; PackageDescription: Axial Device, Thru-Hole; 2 Leads; 0.3 in Pin Spacing
R18 = Res1: 100mW Thick Film Resistors 50V ±1% ±100ppm/℃ 120Ω -55℃~+125℃ 0603 Chip Resistor - Surface Mount ROHS; Published: 8-Jun-2000; LatestRevisionDate: 17-Jul-2002; LatestRevisionNote: Re-released for DXP Platform.; PackageReference: AXIAL-0.3; Publisher: Altium Limited; PackageDescription: Axial Device, Thru-Hole; 2 Leads; 0.3 in Pin Spacing
U5 = M54123L: EARTH LEAKAGE CURRENT DETECTOR

## Sheet B38_Shunt.SchDoc
size A
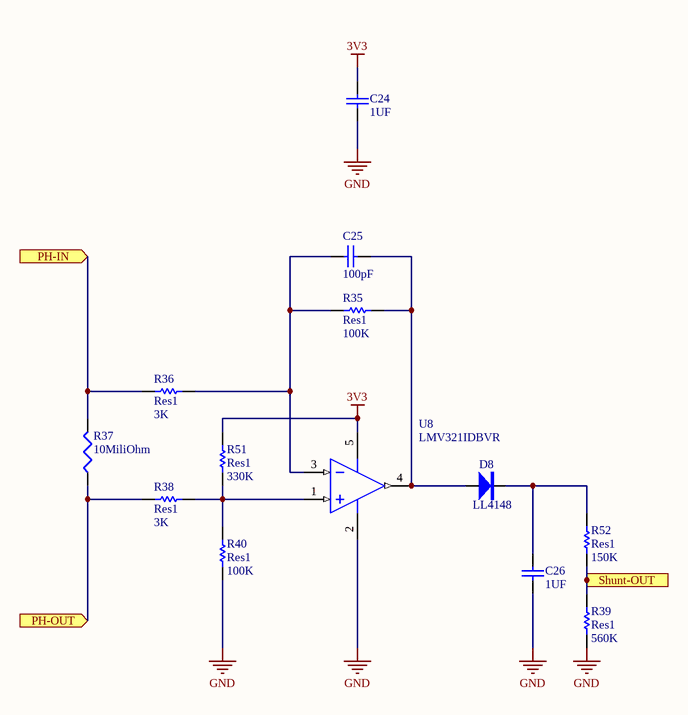
[diagram p13: B38_Shunt.SchDoc]

### Parts
C24  1UF  [CAP0603]
C25  100pF  [CAP0603]
C26  1UF  [CAP0603]
D8  LL4148  [sod-123]
R35  Res1  value 100K  [RES0603]
R36  Res1  value 3K  [RES0603]
R37  10MiliOhm  [SHUNT-10MM]
R38  Res1  value 3K  [RES0603]
R39  Res1  value 560K  [RES0603]
R40  Res1  value 100K  [RES0603]
R51  Res1  value 330K  [RES0603]
R52  Res1  value 150K  [RES0603]
U8  LMV321IDBVR  [SOT23-5]

### Ports
PH-IN (in), PH-OUT (in), Shunt-OUT (out)

### Nets
3V3: C24.1 R51.2 U8.5(VCC+)
GND: C24.2 C26.2 R39.1 R40.1 U8.2(GND)
AC_L: R37.1 R38.1 ; port PH-OUT
Shunt-OUT: R39.2 R52.1 ; port Shunt-OUT
NetC25_1: C25.1 R35.1 R36.2 U8.3(IN-)
NetC25_2: C25.2 D8.1(A) R35.2 U8.4(OUT)
NetC26_1: C26.1 D8.2(K) R52.2
NetF1_1: R36.1 R37.2 ; port PH-IN
NetR38_2: R38.2 R40.2 R51.1 U8.1(IN+)

### Library data of the parts
C24-C26 = CAP-SMT: 1UF ±5% 50V X7R 0603 Multilayer Ceramic Capacitors MLCC - SMD/SMT
  C24 C26: Value: 1UF
  C25: Value: 100pF
D8 = DIODE
R35 R36 R38-R40 R51 R52 = Res1: Resistor; Published: 8-Jun-2000; LatestRevisionDate: 17-Jul-2002; LatestRevisionNote: Re-released for DXP Platform.; PackageReference: AXIAL-0.3; Publisher: Altium Limited; PackageDescription: Axial Device, Thru-Hole; 2 Leads; 0.3 in Pin Spacing
R37 = RES: Resistor
U8 = LM741: Wide Bandwidth JFET Input Operational Amplifier

## Nets that join several sheets
3V3: B38_TopSheet (5 pins), B38_AMS1117-3V3 (C3#1.2 C6.1 U2.2 U2.4), B38_NTC (R32.2), B38_Buzzer (Bz1.1 D2.2), B38_RS485 (C15.2 R27.2 U6.8), B38_ESP32 (5 pins), B38_LCM (6 pins), B38_RF-RMT (L2.2), B38_TOUCH_KEYS (C23.1 U7.10), B38_RCCB_M541231 (R14.1), B38_Shunt (C24.1 R51.2 U8.5)
+5: B38_TopSheet (1.1), B38_AMS1117-3V3 (C4.2 C5.2 U2.3), B38_LCM (J1.2), B38_15v to 5v_MC34063 (C28.1 L3.2 R42.2)
+15: B38_ACtoDC (C1.1 U1.6), B38_Relay (8 pins), B38_15v to 5v_MC34063 (R41.2 U9.6), B38_RCCB_M541231 (Q5.2 R11.2)
GND: B38_TopSheet (5 pins), B38_AMS1117-3V3 (5 pins), B38_NTC (C16.1 S1.2), B38_Buzzer (Q1.2), B38_ACtoDC (C1.2 CY2.2 U1.5), B38_RS485 (C15.1 D7.3 R30.2 U6.5), B38_ESP32 (7 pins), B38_LCM (5 pins), B38_RF-RMT (C17.2 RMT1.3), B38_TOUCH_KEYS (7 pins), B38_15v to 5v_MC34063 (5 pins), B38_RCCB_M541231 (7 pins), B38_Shunt (5 pins)
AC_L: B38_TopSheet (CT1.4), B38_ACtoDC (CY1.2 L1.1), B38_Shunt (R37.1 R38.1)
AC_N: B38_TopSheet (CT1.3 Terminal1.2), B38_ACtoDC (CY1.1 U1.2)
CoM-L: B38_TopSheet (CT1.6), B38_Relay (RL1.3 RL3.1 RL4.3)
GND-RELAY: B38_Relay (8 pins), B38_RCCB_M541231 (Q6.3)
GPIO0: B38_TopSheet (prog.5), B38_ESP32 (R4.1 U3.25)
NetC12_1: B38_TopSheet (CT1.2), B38_RCCB_M541231 (C12.1 R16.2 R18.1)
NetC12_2: B38_TopSheet (CT1.1), B38_RCCB_M541231 (C12.2 C13.1 R18.2 U5.1)
NetC16_2: B38_NTC (C16.2 R32.1 S1.1), B38_ESP32 (U3.14)
NetF1_1: B38_TopSheet (F1.1), B38_Shunt (R36.1 R37.2)
NetQ6_1: B38_ESP32 (U3.33), B38_RCCB_M541231 (Q6.1 Q7.3 R14.2)
NetR2_2: B38_Buzzer (R2.2), B38_ESP32 (U3.16)
NetR5_2: B38_ESP32 (U3.11), B38_LCM (R5.2 U4.9)
NetR6_2: B38_ESP32 (U3.12), B38_LCM (R6.2 U4.11)
NetR7_2: B38_ESP32 (U3.13), B38_LCM (R7.2 U4.12)
NetR9_2: B38_ESP32 (U3.26), B38_LCM (R9.2)
NetR12_1: B38_ESP32 (U3.36), B38_RCCB_M541231 (R12.1)
NetR19_2: B38_ESP32 (U3.30), B38_Relay (R19.2)
NetR20_2: B38_ESP32 (U3.23), B38_Relay (R20.2)
NetR21_2: B38_ESP32 (U3.10), B38_Relay (R21.2)
NetR22_2: B38_ESP32 (U3.24), B38_Relay (R22.2)
NetR34_1: B38_TopSheet (R34.1), B38_ESP32 (U3.7)
NetRL1_2: B38_TopSheet (Terminal1.3), B38_Relay (RL1.2)
NetRL2_3: B38_TopSheet (Terminal1.4), B38_Relay (RL2.3)
NetRL3_3: B38_TopSheet (Terminal1.5), B38_Relay (RL3.3)
NetRL4_1: B38_TopSheet (Terminal1.6), B38_Relay (RL4.1)
NetRMT1_2: B38_ESP32 (U3.4), B38_RF-RMT (RMT1.2)
NetU3_8: B38_ESP32 (U3.8), B38_TOUCH_KEYS (U7.16)
NetU3_9: B38_ESP32 (U3.9), B38_TOUCH_KEYS (U7.15)
NU-RCCB-OUT: B38_TopSheet (CT1.5), B38_Relay (RL2.2)
RS485_DIR: B38_RS485 (R30.1 U6.2 U6.3), B38_ESP32 (U3.29)
RS485_N: B38_TopSheet (Terminal1.7), B38_RS485 (D7.2 R28.2 R29.2)
RS485_P: B38_TopSheet (Terminal1.8), B38_RS485 (D7.1 R29.1 R31.2)
RS485_RX: B38_RS485 (U6.4), B38_ESP32 (U3.28)
RS485_TX: B38_RS485 (R27.1 U6.1), B38_ESP32 (U3.27)
RST: B38_TopSheet (prog.6), B38_ESP32 (C7.2 R3.1 U3.3)
RXD0: B38_TopSheet (prog.3), B38_ESP32 (U3.34)
Shunt-OUT: B38_ESP32 (U3.37), B38_Shunt (R39.2 R52.1)
SW1: B38_TopSheet (R44.2 S2.2), B38_ESP32 (U3.5)
SW2: B38_TopSheet (R45.2 S2.1), B38_ESP32 (U3.6)
TXD0: B38_TopSheet (prog.4), B38_ESP32 (U3.35)